# EAGLE schematic BigLatchingRelayOnAStick (EAGLE 7.4.0)
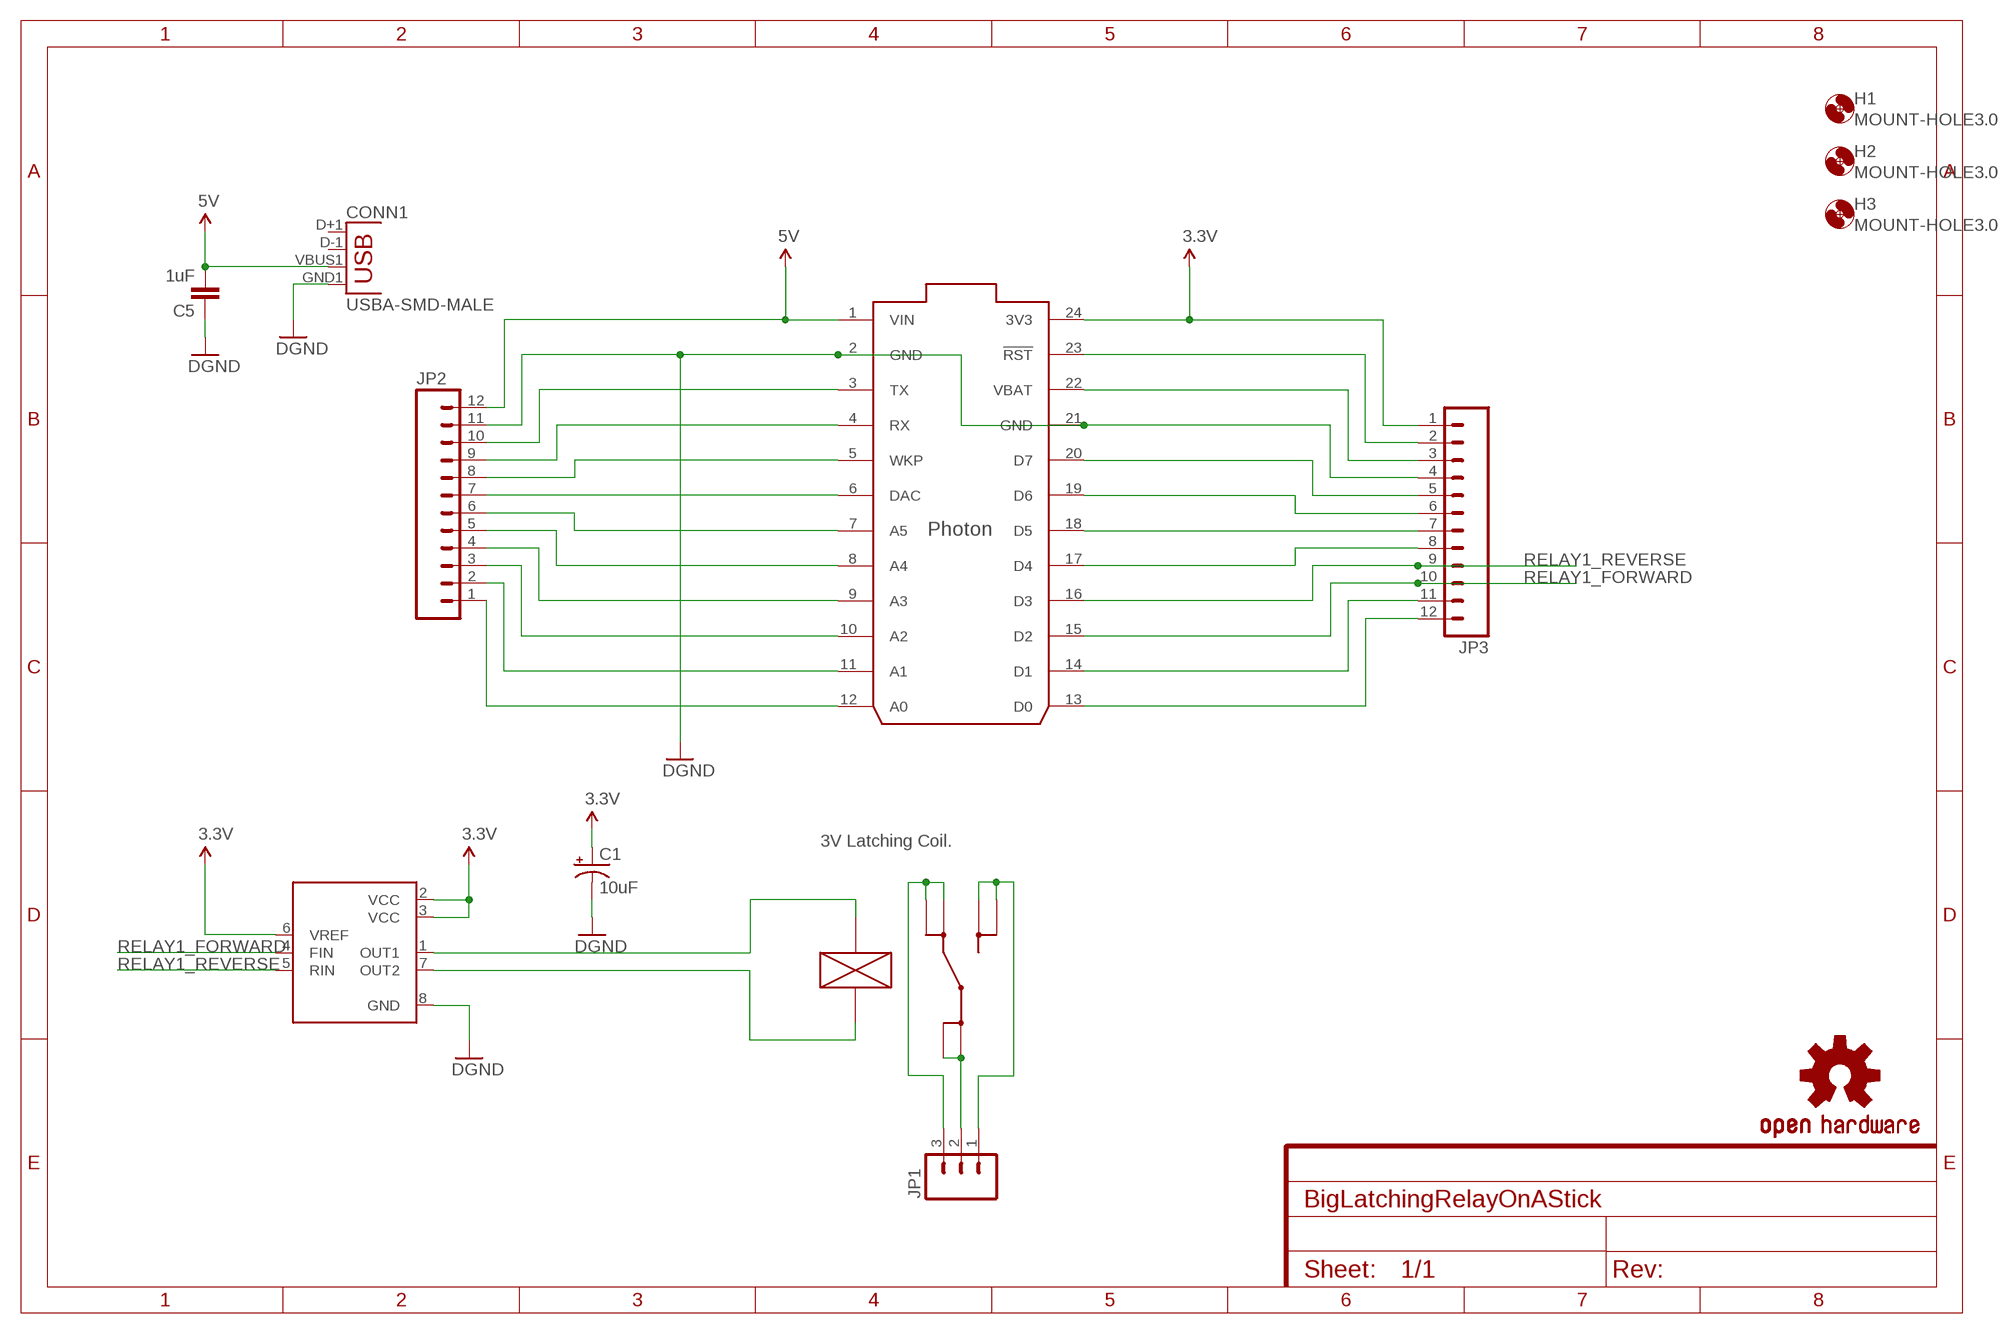
[diagram p0: schematic, sheet 1]

## Parts
C1  10uF  10UF-16V-10%(TANT)  [EIA3216]
C5  1uF  CAP0805  [0805]
CONN1  USBA-SMD-MALE  [USB-A-SMT-MALE]
H1  MOUNT-HOLE3.0  [3,0]
H2  MOUNT-HOLE3.0  [3,0]
H3  MOUNT-HOLE3.0  [3,0]
IC1  PHOTON  PHOTON_WITH_HEADERS  [PHOTON]
IC2  BD6211F  [SOP8]
JP1  M03-SCREW-5MM  [SCREWTERMINAL-5MM-3]
JP2  M121X12_NO_SILK_KIT  [1X12_NO_SILK_KIT]
JP3  M121X12_NO_SILK_KIT  [1X12_NO_SILK_KIT]
LOGO2  OSHW-LOGOS  [OSHW-LOGO-S]
U$1  RELAY_G5RL-1E  [G5RL-1E]

## Nets
3.3V: C1.A(+) IC1.24(3V3) IC2.2(VCC) IC2.3(VCC) IC2.6(VREF) JP3.1
5V: C5.2 CONN1.VBUS1(VBUS) IC1.1(VIN) JP2.12
A1: IC1.11(A1) JP2.2
GND: C1.C(-) C5.1 CONN1.GND1(GND) IC1.2(GND) IC1.21(GND) IC2.8(GND) JP2.11 JP3.4 ; supply symbol labelled DGND
N$1: JP1.2 U$1.COM@1(COM) U$1.COM@2(COM)
N$3: JP1.1 U$1.NO@1(NO) U$1.NO@2(NO)
N$4: JP1.3 U$1.NC@1(NC) U$1.NC@2(NC)
N$7: IC1.23(!RST) JP3.2
N$11: IC1.22(VBAT) JP3.3
N$12: IC2.1(OUT1) U$1.COIL+
N$13: IC2.7(OUT2) U$1.COIL-
N$15: IC1.18(D5) JP3.7
N$16: IC1.17(D4) JP3.8
N$20: IC1.14(D1) JP3.11
N$21: IC1.13(D0) JP3.12
N$22: IC1.3(TX) JP2.10
N$23: IC1.4(RX) JP2.9
N$24: IC1.5(WKP) JP2.8
N$25: IC1.6(DAC) JP2.7
N$26: IC1.7(A5) JP2.6
N$28: IC1.9(A3) JP2.4
N$29: IC1.10(A2) JP2.3
N$31: IC1.12(A0) JP2.1
N$33: IC1.20(D7) JP3.5
N$35: IC1.19(D6) JP3.6
RELAY1_FORWARD: IC1.15(D2) IC2.4(FIN) JP3.10
RELAY1_REVERSE: IC1.16(D3) IC2.5(RIN) JP3.9
RELAYSENSE: IC1.8(A4) JP2.5
Unconnected: CONN1.D+1(D+) CONN1.D-1(D-)

## Notes on the sheet
- 3V Latching Coil.

## Library data of the parts
C1 = SparkFun-Capacitors:10UF-16V-10%(TANT): CAP-00811 1206/EIA-3216 Tantalum capacitor; PROD_ID: CAP-00811
C5 = SparkFun-Passives:CAP: Capacitor Standard 0603 ceramic capacitor, and 0.1" leaded capacitor.
CONN1 = SparkFun-Connectors:USB: USB Connectors USB-B-PTH is fully proven SKU : PRT-00139/CONN-08278 USB-miniB is fully proven SKU : PRT-00587 USB-A-PCB is untested. USB-A-H is throughly reviewed, but untested. Spark Fun Electronics SKU : PRT-00437 USB-B-SMT is throughly reviewed, but untested. Needs silkscreen touching up. USB-A-S has not been used/tested USB-MB-H has not been used/tested USB-MICROB has been used. CONN-09505
H1-H3 = holes:MOUNT-HOLE: MOUNTING HOLE with drill center marker
IC1 = Spark:PHOTON
IC2 = BD6211F:BD6211F
JP1 = SparkFun-Connectors:M03: Header 3 Standard 3-pin 0.1" header. Use with straight break away headers (SKU : PRT-00116), right angle break away headers (PRT-00553), swiss pins (PRT-00743), machine pins (PRT-00117), and female headers (PRT-00115). Molex polarized connector foot print use with SKU : PRT-08232 with associated crimp pins and housings.; STOREFRONT_ID: PRT-08433
JP2 JP3 = SparkFun-Connectors:M12: Header 12 Standard 12-pin 0.1" header. Use with straight break away headers (SKU : PRT-00116), right angle break away headers (PRT-00553), swiss pins (PRT-00743), machine pins (PRT-00117), and female headers (PRT-00115).
LOGO2 = SparkFun-Aesthetics:OSHW-LOGO: Open Source Hardware Logo This logo indicates the piece of hardware it is found on incorporates a OSHW license and/or adheres to the definition of open source hardware found here: http://freedomdefined.org/OSHW
U$1 = RELAY_G5RL-1E:RELAY_G5RL-1E